# Altium project Placa-Mae.PrjPcb
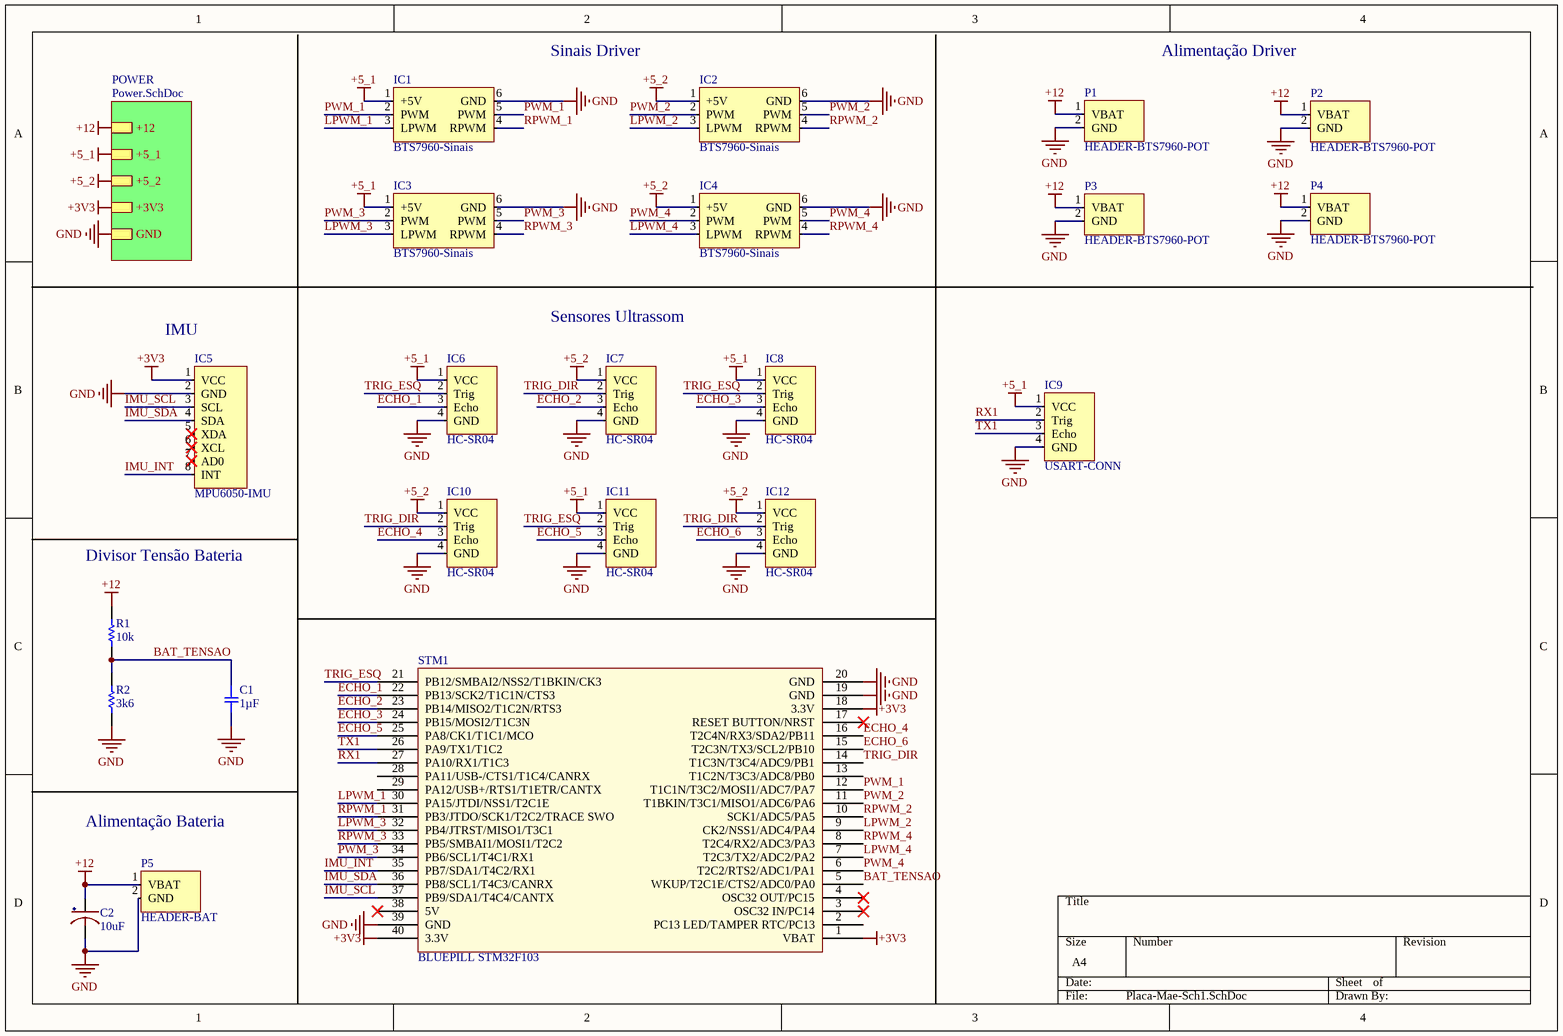
[diagram p0: Placa-Mae-Sch1.SchDoc]
2 sheets, 35 parts. Net scope: hierarchical (ports join the sheet entries above them; power ports are global).
Board file: Placa-Mae-PCB1.PcbDoc
Sheets:
  Placa-Mae-Sch1.SchDoc
    POWER = Power.SchDoc

## Sheet Placa-Mae-Sch1.SchDoc
size A4

### Parts
C1  1µF  [CAPC1608X90N]
C2  10uF  [CAP ALUM 5X5]
IC1  BTS7960-Sinais  [HEADER 3X2 M]
IC2  BTS7960-Sinais  [HEADER 3X2 M]
IC3  BTS7960-Sinais  [HEADER 3X2 M]
IC4  BTS7960-Sinais  [HEADER 3X2 M]
IC5  MPU6050-IMU  [MPU6050-IMU]
IC6  HC-SR04  [HEADER 1X4 F]
IC7  HC-SR04  [HEADER 1X4 F]
IC8  HC-SR04  [HEADER 1X4 F]
IC9  USART-CONN  [HEADER 1X4 F]
IC10  HC-SR04  [HEADER 1X4 F]
IC11  HC-SR04  [HEADER 1X4 F]
IC12  HC-SR04  [HEADER 1X4 F]
P1  HEADER-BTS7960-POT  [XT60-Male]
P2  HEADER-BTS7960-POT  [XT60-Male]
P3  HEADER-BTS7960-POT  [XT60-Male]
P4  HEADER-BTS7960-POT  [XT60-Male]
P5  HEADER-BAT  [XT60-Male]
R1  10k  [RESC1608X55N]
R2  3k6  [RESC1608X55N]
STM1  BLUEPILL STM32F103  [STM32-BLUEPILL]

### Sub-sheets
POWER = Power.SchDoc: +12, +5_1, +5_2, +3V3, GND

### Nets
+3V3: IC5.1(VCC) STM1.1(VBAT) STM1.18(3.3V) STM1.40(3.3V) ; sheet POWER/+3V3
+5_1: IC1.1(+5V) IC3.1(+5V) IC6.1(VCC) IC8.1(VCC) IC9.1(VCC) IC11.1(VCC) ; sheet POWER/+5_1
+5_2: IC2.1(+5V) IC4.1(+5V) IC7.1(VCC) IC10.1(VCC) IC12.1(VCC) ; sheet POWER/+5_2
+12: C2.1 P1.1(VBAT) P2.1(VBAT) P3.1(VBAT) P4.1(VBAT) P5.1(VBAT) R1.2 ; sheet POWER/+12
GND: C1.2 C2.2 IC1.6(GND) IC2.6(GND) IC3.6(GND) IC4.6(GND) IC5.2(GND) IC6.4(GND) IC7.4(GND) IC8.4(GND) IC9.4(GND) IC10.4(GND) IC11.4(GND) IC12.4(GND) P1.2(GND) P2.2(GND) P3.2(GND) P4.2(GND) P5.2(GND) R2.1 STM1.19(GND) STM1.20(GND) STM1.39(GND) ; sheet POWER/GND
BAT_TENSAO: C1.1 R1.1 R2.2 STM1.5(WKUP/T2C1E/CTS2/ADC0/PA0)
ECHO_1: IC6.3(Echo) STM1.22(PB13/SCK2/T1C1N/CTS3)
ECHO_2: IC7.3(Echo) STM1.23(PB14/MISO2/T1C2N/RTS3)
ECHO_3: IC8.3(Echo) STM1.24(PB15/MOSI2/T1C3N)
ECHO_4: IC10.3(Echo) STM1.16(T2C4N/RX3/SDA2/PB11)
ECHO_5: IC11.3(Echo) STM1.25(PA8/CK1/T1C1/MCO)
ECHO_6: IC12.3(Echo) STM1.15(T2C3N/TX3/SCL2/PB10)
IMU_INT: IC5.8(INT) STM1.35(PB7/SDA1/T4C2/RX1)
IMU_SCL: IC5.3(SCL) STM1.37(PB9/SDA1/T4C4/CANTX)
IMU_SDA: IC5.4(SDA) STM1.36(PB8/SCL1/T4C3/CANRX)
LPWM_1: IC1.3(LPWM) STM1.30(PA15/JTDI/NSS1/T2C1E)
LPWM_2: IC2.3(LPWM) STM1.9(CK2/NSS1/ADC4/PA4)
LPWM_3: IC3.3(LPWM) STM1.32(PB4/JTRST/MISO1/T3C1)
LPWM_4: IC4.3(LPWM) STM1.7(T2C3/TX2/ADC2/PA2)
PWM_1: IC1.2(PWM) IC1.5(PWM) STM1.12(T1C1N/T3C2/MOSI1/ADC7/PA7)
PWM_2: IC2.2(PWM) IC2.5(PWM) STM1.11(T1BKIN/T3C1/MISO1/ADC6/PA6)
PWM_3: IC3.2(PWM) IC3.5(PWM) STM1.34(PB6/SCL1/T4C1/RX1)
PWM_4: IC4.2(PWM) IC4.5(PWM) STM1.6(T2C2/RTS2/ADC1/PA1)
RPWM_1: IC1.4(RPWM) STM1.31(PB3/JTDO/SCK1/T2C2/TRACE_SWO)
RPWM_2: IC2.4(RPWM) STM1.10(SCK1/ADC5/PA5)
RPWM_3: IC3.4(RPWM) STM1.33(PB5/SMBAI1/MOSI1/T2C2)
RPWM_4: IC4.4(RPWM) STM1.8(T2C4/RX2/ADC3/PA3)
RX1: IC9.2(Trig) STM1.27(PA10/RX1/T1C3)
TRIG_DIR: IC7.2(Trig) IC10.2(Trig) IC12.2(Trig) STM1.14(T1C3N/T3C4/ADC9/PB1)
TRIG_ESQ: IC6.2(Trig) IC8.2(Trig) IC11.2(Trig) STM1.21(PB12/SMBAI2/NSS2/T1BKIN/CK3)
TX1: IC9.3(Echo) STM1.26(PA9/TX1/T1C2)

Not connected (* = marked no-connect by the designer): IC5 5(XDA)* 6(XCL)* 7(AD0)*; STM1 2(PC13_LED/TAMPER_RTC/PC13) 3(OSC32_IN/PC14)* 4(OSC32_OUT/PC15)* 13(T1C2N/T3C3/ADC8/PB0) 17(RESET_BUTTON/NRST)* 28(PA11/USB-/CTS1/T1C4/CANRX) 29(PA12/USB+/RTS1/T1ETR/CANTX) 38(5V)*

### Notes on the sheet
- Sinais Driver
- (near P2) Alimentação Driver
- (near IC5) IMU
- Sensores Ultrassom
- Divisor Tensão Bateria
- Alimentação Bateria

### Library data of the parts
C1 = GCJ188R71C104KA01D: CAP CER 0.1UF 16V X7R 0603; Manufacturer: Murata Electronics North America; Factory Stock: 0; Unit Price (USD): 0.21; Minimum Quantity: 1; Tolerance: ±10%; Datasheets: http://www.murata.com/~/media/webrenewal/support/library/catalog/products/capacitor/mlcc/c03e.ashx; Image: //media.digikey.com/Renders/Murata%20Renders/0603%28LQG18%29.jpg; Digi-Key Part Number: 490-5796-1-ND; Part Number: GCJ188R71C104KA01D; Quantity Available: 22473; @ qty: 0; Packaging: Cut Tape (CT); Series: GCJ; Part Status: Active; Value: 1µF; Voltage: 16V; Temperature Coefficient: X7R; Operating Temperature: -55°C ~ 125°C; Features: Soft Termination; Ratings: AEC-Q200; Applications: Automotive, Boardflex Sensitive; Mounting Type: Surface Mount, MLCC; Package / Case: 0603 (1608 Metric); Size / Dimension: 0.063" L x 0.031" W (1.60mm x 0.80mm); Height - Seated (Max): -; Thickness (Max): 0.035" (0.90mm); Lead Spacing: -; Lead Style: -
C2 = CAP ALUM 25V 10uF: Aluminum Electrolytic Capacitors - SMD 25volts 10uF 5x5.4 20%; Mfr: Nichion; Mfr Nr: UWX1E100MCL1GB; Voltage Rating: 25V; Type: Surface Mount Aluminum Electrolytic Capacitor; Dimensions: 5x5mm; Series: UWX; Value: 10uF
IC1-IC4 = BTS7960-Sinais: Conector com os sinais de controle de velocidade do driver BTS7960
IC6-IC12 = HC-SR04: Sensor Ultrassom
R1 R2 = RES 1K 0402: RES SMD 20 OHM 1% 1/16W 0603
  R1: Value: 10k
  R2: Value: 3k6
STM1 = STM32-BLUEPILL: STM32 Blue Pill Development Module

## Sheet Power.SchDoc
size A4
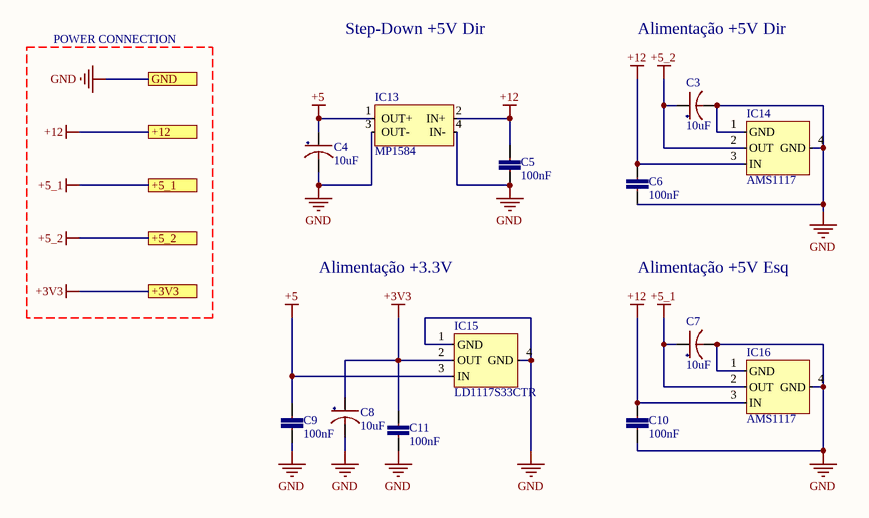
[diagram p1: Power.SchDoc]

### Parts
C3  10uF  [CAP ALUM 5X5]
C4  10uF  [CAP ALUM 5X5]
C5  100nF  [CAP CER 0603]
C6  100nF  [CAP CER 0603]
C7  10uF  [CAP ALUM 5X5]
C8  10uF  [CAP ALUM 5X5]
C9  100nF  [CAP CER 0603]
C10  100nF  [CAP CER 0603]
C11  100nF  [CAP CER 0603]
IC13  MP1584  [MP1584]
IC14  AMS1117  [SOT-223]
IC15  LD1117S33CTR  [SOT-223]
IC16  AMS1117  [SOT-223]

### Ports
+3V3, +5_1, +5_2, +12, GND

### Nets
+3V3: C8.1 C11.2 IC15.2(OUT) ; port +3V3
+5: C4.1 C9.2 IC13.1(OUT+) IC15.3(IN)
+5_1: C7.1 IC16.2(OUT) ; port +5_1
+5_2: C3.1 IC14.2(OUT) ; port +5_2
+12: C5.2 C6.2 C10.2 IC13.2(IN+) IC14.3(IN) IC16.3(IN) ; port +12
GND: C3.2 C4.2 C5.1 C6.1 C7.2 C8.2 C9.1 C10.1 C11.1 IC13.3(OUT-) IC13.4(IN-) IC14.1(GND) IC14.4(GND) IC15.1(GND) IC15.4(GND) IC16.1(GND) IC16.4(GND) ; port GND

### Notes on the sheet
- POWER CONNECTION
- Step-Down +5V Dir
- Alimentação +5V Dir
- Alimentação +3.3V
- Alimentação +5V Esq

### Library data of the parts
C3 C4 C7 C8 = CAP ALUM 25V 10uF: as C2 on sheet Placa-Mae-Sch1; Dimensions: 5x5mm; Series: UWX; Value: 10uF
C5 C6 C9-C11 = CAP CER 0603 25V 100nF: Multilayer Ceramic Capacitors MLCC - SMD/SMT 25V 0.1uF 0603 Y5V -20/+80%; Mfr Nr: C0603C104Z3VACTU; Mfr: KEMET; Type: Ceramic Capacitor; Dimensions: 0603 (1608 metric); Voltage Rating: 25V; Series: SMD Comm Y5V; Value: 100nF
IC14 IC16 = AMS1117: LDO Voltage Regulators 5V 1A; Mfr: STMicroelectronics; Series: LD1117; Package: SOT-223-3
IC15 = LD1117S33CTR: LDO Voltage Regulators 3.3V 0.8A Positive; Mfr: STMicroelectronics; Series: LD1117; Package: SOT-223-3

## Nets that join several sheets
+3V3: Placa-Mae-Sch1 (IC5.1 STM1.1 STM1.18 STM1.40), Power (C8.1 C11.2 IC15.2)
+5_1: Placa-Mae-Sch1 (6 pins), Power (C7.1 IC16.2)
+5_2: Placa-Mae-Sch1 (5 pins), Power (C3.1 IC14.2)
+12: Placa-Mae-Sch1 (7 pins), Power (6 pins)
GND: Placa-Mae-Sch1 (23 pins), Power (17 pins)